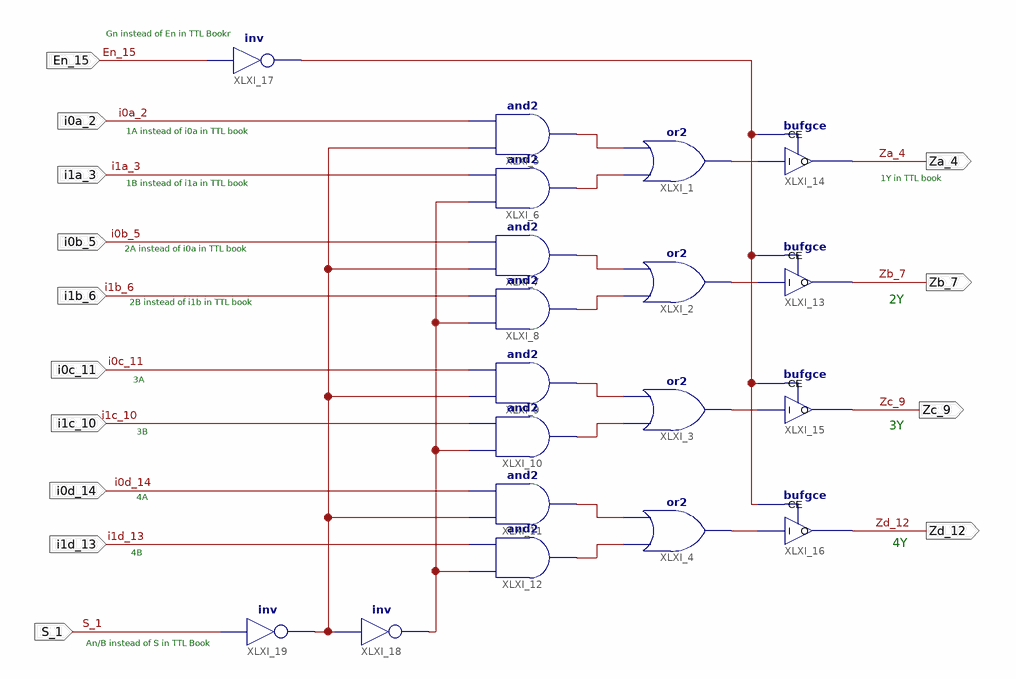
[diagram p0: schematic sheet 1]
// Xilinx ISE schematic chip74LS257.sch (spartan3e) as structural Verilog: 19 symbols, 14 ports
module chip74LS257 (
  input  En_15,
  input  S_1,
  input  i0a_2,
  input  i1a_3,
  input  i0b_5,
  input  i1b_6,
  input  i0c_11,
  input  i1c_10,
  input  i0d_14,
  input  i1d_13,
  output Za_4,
  output Zb_7,
  output Zc_9,
  output Zd_12
);

  wire XLXN_1, XLXN_2, XLXN_3, XLXN_4, XLXN_5, XLXN_6, XLXN_7, XLXN_8, XLXN_9, XLXN_10, XLXN_11, XLXN_12,
       XLXN_15, XLXN_17, XLXN_20;

  or XLXI_1 (XLXN_9, XLXN_2, XLXN_1);
  or XLXI_2 (XLXN_10, XLXN_4, XLXN_3);
  or XLXI_3 (XLXN_11, XLXN_6, XLXN_5);
  or XLXI_4 (XLXN_12, XLXN_8, XLXN_7);
  and XLXI_5 (XLXN_1, XLXN_20, i0a_2);
  and XLXI_6 (XLXN_2, XLXN_17, i1a_3);
  and XLXI_7 (XLXN_3, XLXN_20, i0b_5);
  and XLXI_8 (XLXN_4, XLXN_17, i1b_6);
  and XLXI_9 (XLXN_5, XLXN_20, i0c_11);
  and XLXI_10 (XLXN_6, XLXN_17, i1c_10);
  and XLXI_11 (XLXN_7, XLXN_20, i0d_14);
  and XLXI_12 (XLXN_8, XLXN_17, i1d_13);
  bufgce XLXI_13 (.CE(XLXN_15), .I(XLXN_10), .O(Zb_7));
  bufgce XLXI_14 (.CE(XLXN_15), .I(XLXN_9), .O(Za_4));
  bufgce XLXI_15 (.CE(XLXN_15), .I(XLXN_11), .O(Zc_9));
  bufgce XLXI_16 (.CE(XLXN_15), .I(XLXN_12), .O(Zd_12));
  not XLXI_17 (XLXN_15, En_15);
  not XLXI_18 (XLXN_17, XLXN_20);
  not XLXI_19 (XLXN_20, S_1);

  // Notes on the sheet:
  //   Gn instead of En in TTL Bookr
  //   1A instead of i0a in TTL book
  //   1Y in TTL book
  //   1B instead of i1a in TTL book
  //   2A instead of i0a in TTL book
  //   2Y
  //   2B instead of i1b in TTL book
  //   3A
  //   3Y
  //   3B
  //   4A
  //   4Y
  //   4B
  //   An/B instead of S in TTL Book
endmodule
